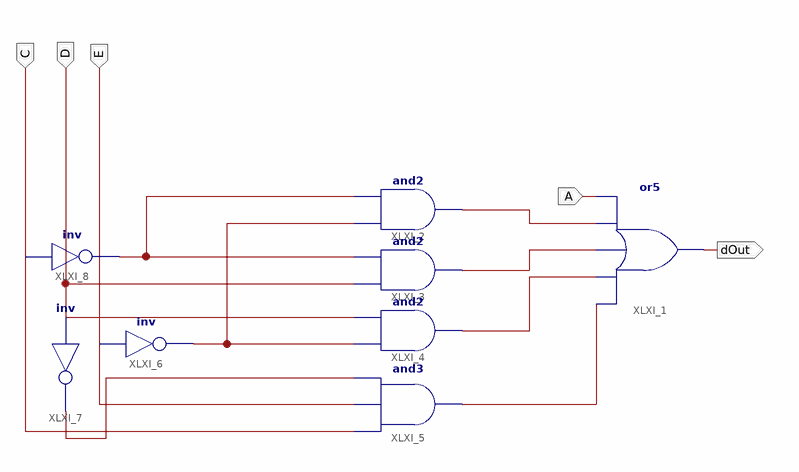
[diagram p0: schematic sheet 1]
// Xilinx ISE schematic d.sch (xa9500xl) as structural Verilog: 8 symbols, 5 ports
module d (
  input  A,
  input  C,
  input  D,
  input  E,
  output dOut
);

  wire XLXN_1, XLXN_2, XLXN_3, XLXN_5, XLXN_19, XLXN_21, XLXN_22;

  or XLXI_1 (dOut, XLXN_1, XLXN_2, XLXN_3, XLXN_5, A);
  and XLXI_2 (XLXN_5, XLXN_22, XLXN_21);
  and XLXI_3 (XLXN_3, D, XLXN_21);
  and XLXI_4 (XLXN_2, XLXN_22, D);
  and XLXI_5 (XLXN_1, C, E, XLXN_19);
  not XLXI_6 (XLXN_22, E);
  not XLXI_7 (XLXN_19, D);
  not XLXI_8 (XLXN_21, C);
endmodule
